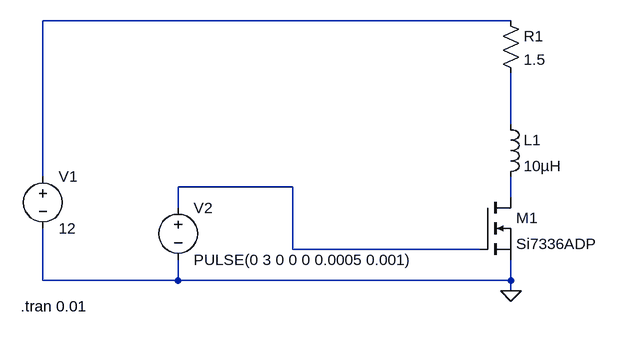
[diagram p0: schematic MosfetOutputs.asc]
MosfetOutputs.asc, the LTspice schematic file:
Version 4
SHEET 1 880 680
WIRE 192 -64 -528 -64
WIRE 192 96 192 16
WIRE -528 176 -528 -64
WIRE -144 192 -320 192
WIRE 192 208 192 176
WIRE -320 224 -320 192
WIRE -144 288 -144 192
WIRE 144 288 -144 288
WIRE -528 336 -528 256
WIRE -320 336 -320 304
WIRE -320 336 -528 336
WIRE 192 336 192 304
WIRE 192 336 -320 336
WIRE 192 352 192 336
FLAG 192 352 0
SYMBOL ind 176 80 R0
SYMATTR InstName L1
SYMATTR Value 10µH
SYMBOL res 176 -80 R0
SYMATTR InstName R1
SYMATTR Value 1.5
SYMBOL nmos 144 208 R0
SYMATTR InstName M1
SYMATTR Value Si7336ADP
SYMBOL voltage -528 160 R0
WINDOW 123 0 0 Left 0
WINDOW 39 0 0 Left 0
SYMATTR InstName V1
SYMATTR Value 12
SYMBOL voltage -320 208 R0
WINDOW 123 0 0 Left 0
WINDOW 39 0 0 Left 0
SYMATTR InstName V2
SYMATTR Value PULSE(0 3 0 0 0 0.0005 0.001)
TEXT -562 376 Left 2 !.tran 0.01

The netlist it stands for:
* MosfetOutputs.asc
L1 N002 N004 10µH
R1 N001 N002 1.5
M1 N004 N003 0 0 Si7336ADP
V1 N001 0 12
V2 N003 0 PULSE(0 3 0 0 0 0.0005 0.001)
.model NMOS NMOS
.model PMOS PMOS
.lib standard.mos
.tran 0.01
.backanno
.end